# EAGLE design type-2 4 button (EAGLE 9.6.2)
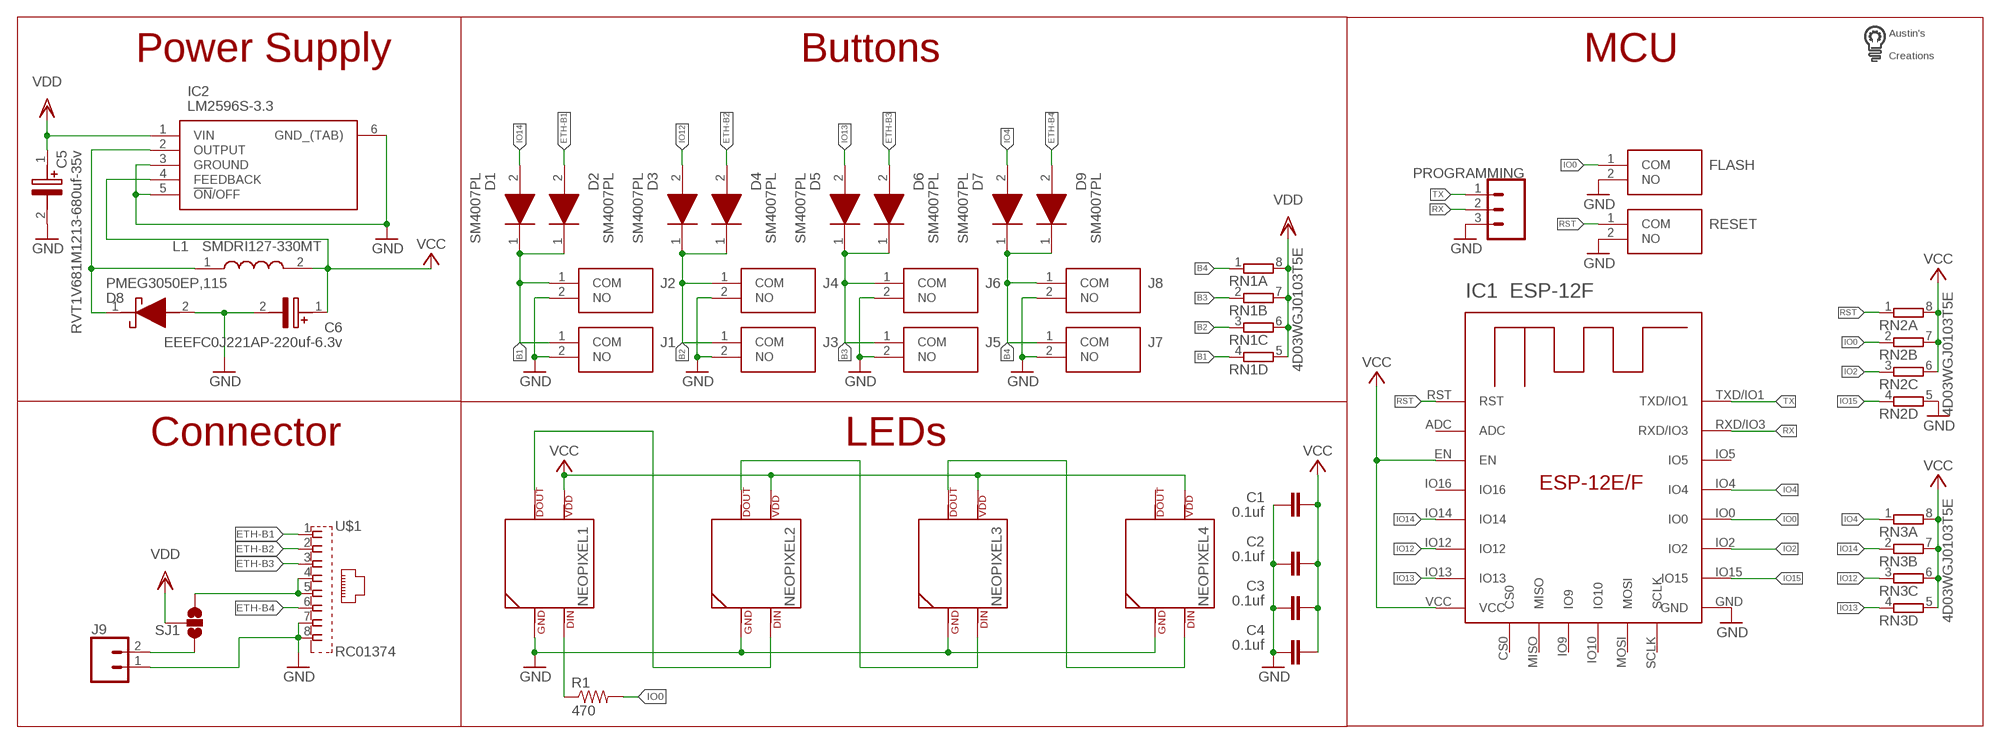
[diagram p0: schematic, sheet 1]

## Parts
C1  0.1uf  C-EUC0603  [C0603]
C2  0.1uf  C-EUC0603  [C0603]
C3  0.1uf  C-EUC0603  [C0603]
C4  0.1uf  C-EUC0603  [C0603]
C5  RVT1V681M1213-680uf-35v  EEE-HD1V681AQ  [CAPAE1350X1400N]
C6  EEEFC0J221AP-220uf-6.3v  EEEFC0J221AP  [CAPAE830X650N]
D1  SM4007PL  [SODFL3718X125N]
D2  SM4007PL  [SODFL3718X125N]
D3  SM4007PL  [SODFL3718X125N]
D4  SM4007PL  [SODFL3718X125N]
D5  SM4007PL  [SODFL3718X125N]
D6  SM4007PL  [SODFL3718X125N]
D7  SM4007PL  [SODFL3718X125N]
D8  PMEG3050EP,115  [PMEG3050EP115]
D9  SM4007PL  [SODFL3718X125N]
FLASH  PTS636_SM25F_SMTR_LFS  [PTS636SM25FSMTRLFS]
IC1  ESP-12F  ESP-12E/F  [ESP-12E]
IC2  LM2596S-3.3  LM2596S-3.3_NOPB  [TO170P1435X465-6N]
J1  PTS636_SM25F_SMTR_LFS  [PTS636SM25FSMTRLFS]
J2  PTS636_SM25F_SMTR_LFS  [PTS636SM25FSMTRLFS]
J3  PTS636_SM25F_SMTR_LFS  [PTS636SM25FSMTRLFS]
J4  PTS636_SM25F_SMTR_LFS  [PTS636SM25FSMTRLFS]
J5  PTS636_SM25F_SMTR_LFS  [PTS636SM25FSMTRLFS]
J6  PTS636_SM25F_SMTR_LFS  [PTS636SM25FSMTRLFS]
J7  PTS636_SM25F_SMTR_LFS  [PTS636SM25FSMTRLFS]
J8  PTS636_SM25F_SMTR_LFS  [PTS636SM25FSMTRLFS]
J9  CONN_025MM  [SCREWTERMINAL-5MM-2]
L1  SMDRI127-330MT  CDRH127_LDNP-330MC  [INDPM120120X800N]
NEOPIXEL1  SK6812NEOPIXEL5050  [SK6812]
NEOPIXEL2  SK6812NEOPIXEL5050  [SK6812]
NEOPIXEL3  SK6812NEOPIXEL5050  [SK6812]
NEOPIXEL4  SK6812NEOPIXEL5050  [SK6812]
PROGRAMMING  455-1750-1-ND  CONN_03  [1X03]
R1  470  R-US_R0603  [R0603]
RESET  PTS636_SM25F_SMTR_LFS  [PTS636SM25FSMTRLFS]
RN1  4R-N0603-ARC  [0603-ARC]
RN2  4R-N0603-ARC  [0603-ARC]
RN3  4R-N0603-ARC  [0603-ARC]
SJ1  SOLDERJUMPER_2WAYPASTE1&2  [SJ_3_PASTE1&2]
U$1  RC01374  [RC01374]
U$2  LOGO  [LOGO]

## Nets
B1: D1.1(K) D2.1(K) J1.1(COM) J2.1(COM) RN1.4
B2: D3.1(K) D4.1(K) J3.1(COM) J4.1(COM) RN1.3
B3: D5.1(K) D6.1(K) J5.1(COM) J6.1(COM) RN1.2
B4: D7.1(K) D9.1(K) J7.1(COM) J8.1(COM) RN1.1
ETH-B1: D2.2(A) U$1.1
ETH-B2: D4.2(A) U$1.2
ETH-B3: D6.2(A) U$1.3
ETH-B4: D9.2(A) U$1.6
GND: C1.1 C2.1 C3.1 C4.1 C5.2(-) C6.2(-) D8.2(A) FLASH.2(NO) IC1.GND IC2.3(GROUND) IC2.5(!ON!/OFF) IC2.6(GND_(TAB)) J1.2(NO) J2.2(NO) J3.2(NO) J4.2(NO) J5.2(NO) J6.2(NO) J7.2(NO) J8.2(NO) J9.1 NEOPIXEL1.3(GND) NEOPIXEL2.3(GND) NEOPIXEL3.3(GND) NEOPIXEL4.3(GND) PROGRAMMING.3 RESET.2(NO) RN2.5 U$1.7 U$1.8
IO0: FLASH.1(COM) IC1.IO0 R1.2 RN2.2
IO2: IC1.IO2 RN2.3
IO4: D7.2(A) IC1.IO4 RN3.1
IO12: D3.2(A) IC1.IO12 RN3.3
IO13: D5.2(A) IC1.IO13 RN3.4
IO14: D1.2(A) IC1.IO14 RN3.2
IO15: IC1.IO15 RN2.4
N$1: NEOPIXEL1.2(DOUT) NEOPIXEL2.4(DIN)
N$2: NEOPIXEL2.2(DOUT) NEOPIXEL3.4(DIN)
N$3: NEOPIXEL3.2(DOUT) NEOPIXEL4.4(DIN)
N$5: NEOPIXEL1.4(DIN) R1.1
N$6: J9.2 SJ1.3
N$12: SJ1.1 U$1.4 U$1.5
N$20: D8.1(K) IC2.2(OUTPUT) L1.1
RST: IC1.RST RESET.1(COM) RN2.1
RX: IC1.RXD/IO3 PROGRAMMING.2
TX: IC1.TXD/IO1 PROGRAMMING.1
VCC: C1.2 C2.2 C3.2 C4.2 C6.1(+) IC1.EN IC1.VCC IC2.4(FEEDBACK) L1.2 NEOPIXEL1.1(VDD) NEOPIXEL2.1(VDD) NEOPIXEL3.1(VDD) NEOPIXEL4.1(VDD) RN2.6 RN2.7 RN2.8 RN3.5 RN3.6 RN3.7 RN3.8
VDD: C5.1(+) IC2.1(VIN) RN1.5 RN1.6 RN1.7 RN1.8 SJ1.2
Unconnected: IC1.ADC IC1.CS0 IC1.IO5 IC1.IO9 IC1.IO10 IC1.IO16 IC1.MISO IC1.MOSI IC1.SCLK NEOPIXEL4.2(DOUT)

## Notes on the sheet
- Power Supply | Buttons | MCU
- 4D03WGJ0103T5E
- 4D03WGJ0103T5E
- Connector | LEDs
- 4D03WGJ0103T5E

## Library data of the parts
C1-C4 = rcl:C-EU: CAPACITOR, European symbol; SPICEPREFIX: C
C5 = SamacSys_Parts:EEE-HD1V681AQ: Aluminium Electrolytic Capacitors - SMD 35VDC 680uF 20% AEC-Q200 Source: Datasheet <https://industrial.panasonic.com/cdbs/www-data/pdf/RDE0000/ABA0000C1166.pdf>; DESCRIPTION: Aluminium Electrolytic Capacitors - SMD 35VDC 680uF 20% AEC-Q200; HEIGHT: 14mm; MANUFACTURER_NAME: Panasonic; MANUFACTURER_PART_NUMBER: EEE-HD1V681AQ; MOUSER_PART_NUMBER: 667-EEE-HD1V681AQ; MOUSER_PRICE-STOCK: https://www.mouser.co.uk/ProductDetail/Panasonic/EEE-HD1V681AQ?qs=w%2Fv1CP2dgqoW7i2Hoqi%252B9w%3D%3D
C6 = SamacSys_Parts:EEEFC0J221AP: PANASONIC - EEEFC0J221AP - SMD Aluminium Electrolytic Capacitor, Radial Can - SMD, 220 F, 6.3 V, EEEFC Series Source: Datasheet <https://industrial.panasonic.com/cdbs/www-data/pdf/RDE0000/ABA0000C1169.pdf>; DESCRIPTION: PANASONIC - EEEFC0J221AP - SMD Aluminium Electrolytic Capacitor, Radial Can - SMD, 220 F, 6.3 V, EEEFC Series; HEIGHT: 6.5mm; MANUFACTURER_NAME: Panasonic; MANUFACTURER_PART_NUMBER: EEEFC0J221AP
D1-D7 D9 = SamacSys_Parts:SM4007PL: 1kV 1A 1.1V @ 1A SOD-123FL Diodes - General Purpose RoHS Source: Datasheet <https://datasheet.lcsc.com/szlcsc/1903051030_MDD-Jiangsu-Yutai-Elec-SM4007PL_C64898.pdf>; DESCRIPTION: 1kV 1A 1.1V @ 1A SOD-123FL Diodes - General Purpose RoHS; HEIGHT: 1.25mm; MANUFACTURER_NAME: MDD(Microdiode Electronics); MANUFACTURER_PART_NUMBER: SM4007PL
D8 = SamacSys_Parts:PMEG3050EP,115: NXP PMEG3050EP,115 SMT Schottky Diode, 30V 5A, 2-Pin SOD-128 Source: Datasheet <https://docs-emea.rs-online.com/webdocs/14cd/0900766b814cd012.pdf>; ARROW_PART_NUMBER: PMEG3050EP,115; ARROW_PRICE-STOCK: https://www.arrow.com/en/products/pmeg3050ep115/nexperia; DESCRIPTION: NXP PMEG3050EP,115 SMT Schottky Diode, 30V 5A, 2-Pin SOD-128; HEIGHT: 1mm; MANUFACTURER_NAME: Nexperia; MANUFACTURER_PART_NUMBER: PMEG3050EP,115; MOUSER_PART_NUMBER: 771-PMEG3050EP115; MOUSER_PRICE-STOCK: https://www.mouser.co.uk/ProductDetail/Nexperia/PMEG3050EP115?qs=GcY6OjH1zdmnjQ%2FhUT5aOA%3D%3D
FLASH J1-J8 RESET = SamacSys_Parts:PTS636_SM25F_SMTR_LFS: Tactile Switches Tact 50mA 12VDC, 6.0x3.5, 2.5mm H, 180gf, F leads, No ground pin, White Actuator Source: Datasheet <https://ms.componentsearchengine.com/Datasheets/1/PTS636 SM25F SMTR LFS.pdf>; ARROW_PART_NUMBER: PTS636 SM25F SMTR LFS; ARROW_PRICE-STOCK: https://www.arrow.com/en/products/pts636-sm25f-smtr-lfs/ck; DESCRIPTION: Tactile Switches Tact 50mA 12VDC, 6.0x3.5, 2.5mm H, 180gf, F leads, No ground pin, White Actuator; HEIGHT: 2.7mm; MANUFACTURER_NAME: C & K COMPONENTS; MANUFACTURER_PART_NUMBER: PTS636 SM25F SMTR LFS; MOUSER_PART_NUMBER: 611-PTS636SM25FSMTRL; MOUSER_PRICE-STOCK: https://www.mouser.co.uk/ProductDetail/CK/PTS636-SM25F-SMTR-LFS?qs=vLWxofP3U2wcBTQSwfMFOw%3D%3D
IC1 = custom parts:ESP-12E/F
IC2 = SamacSys_Parts:LM2596S-3.3_NOPB: SIMPLE SWITCHER® 4.5V to 40V, 3A Low Component Count Step-Down Regulator Source: Datasheet <http://www.ti.com/lit/ds/symlink/lm2596.pdf>; DESCRIPTION: SIMPLE SWITCHER&#174; 4.5V to 40V, 3A Low Component Count Step-Down Regulator; HEIGHT: 4.65mm; MANUFACTURER_NAME: Texas Instruments; MANUFACTURER_PART_NUMBER: LM2596S-3.3/NOPB; MOUSER_PART_NUMBER: 926-LM2596S-3.3/NOPB; MOUSER_PRICE-STOCK: https://www.mouser.co.uk/ProductDetail/Texas-Instruments/LM2596S-33-NOPB?qs=X1J7HmVL2ZHsEwG9Q6doow%3D%3D
J9 = SparkFun-Connectors:CONN_02: Multi connection point. Often used as Generic Header-pin footprint for 0.1 inch spaced/style header connections On any of the 0.1 inch spaced packages, you can populate with these: Break Away Headers - Straight <https://www.sparkfun.com/products/116> (PRT-00116) Break Away Male Headers - Right Angle <https://www.sparkfun.com/products/553> (PRT-00553) Female Headers <https://www.sparkfun.com/products/115> (PRT-00115) Break Away Headers - Machine Pin <https://www.sparkfun.com/products/117> (PRT-00117) Break Away Female Headers - Swiss Machine Pin <https://www.sparkfun.com/products/743> (PRT-00743) For SCREWTERMINALS and SPRING TERMINALS visit here: Screw Terimnals on SparkFun.com <https://www.sparkfun.com/search/results?term=Screw+Terminals> (5mm/3.5mm/2.54mm spacing) This device is also useful as a general connection point to wire up your design to another part of your project. Our various solder wires solder well into these plated through hole pads. Hook-Up Wire - Assortment (Stranded, 22 AWG) <https://www.sparkfun.com/products/11375> (PRT-11375) Hook-Up Wire - Assortment (Solid Core, 22 AWG) <https://www.sparkfun.com/products/11367> (PRT-11367) View the entire wire category on our website here <https://www.sparkfun.com/categories/141> Special notes: Molex polarized connector foot print use with: PRT-08233 with associated crimp pins and housings. 2.54_SCREWTERM for use with PRT-10571. 3.5mm Screw Terminal footprints for PRT-08084 5mm Screw Terminal footprints for use with PRT-08432; SF_SKU: PRT-08432
L1 = SamacSys_Parts:CDRH127_LDNP-330MC: Fixed Inductors 33uH 3.9A Source: Datasheet <https://products.sumida.com/products/pdf/CDRH127LD.pdf>; DESCRIPTION: Fixed Inductors 33uH 3.9A; HEIGHT: 8mm; MANUFACTURER_NAME: Sumida; MANUFACTURER_PART_NUMBER: CDRH127/LDNP-330MC; MOUSER_PART_NUMBER: 851-CDRH127LDNP330MC; MOUSER_PRICE-STOCK: https://www.mouser.co.uk/ProductDetail/Sumida/CDRH127-LDNP-330MC?qs=rZntyWl5IYHj3wgmnQ0WOg%3D%3D
NEOPIXEL1-NEOPIXEL4 = custom parts:SK6812: for 5050 sk6812 LED
PROGRAMMING = SparkFun-Connectors:CONN_03: Multi connection point. Often used as Generic Header-pin footprint for 0.1 inch spaced/style header connections On any of the 0.1 inch spaced packages, you can populate with these: Break Away Headers - Straight <https://www.sparkfun.com/products/116> (PRT-00116) Break Away Male Headers - Right Angle <https://www.sparkfun.com/products/553> (PRT-00553) Female Headers <https://www.sparkfun.com/products/115> (PRT-00115) Break Away Headers - Machine Pin <https://www.sparkfun.com/products/117> (PRT-00117) Break Away Female Headers - Swiss Machine Pin <https://www.sparkfun.com/products/743> (PRT-00743) Stackable Header - 3 Pin (Female, 0.1") <https://www.sparkfun.com/products/13875> (PRT-13875) For SCREWTERMINALS and SPRING TERMINALS visit here: Screw Terimnals on SparkFun.com <https://www.sparkfun.com/search/results?term=Screw+Terminals> (5mm/3.5mm/2.54mm spacing) This device is also useful as a general connection point to wire up your design to another part of your project. Our various solder wires solder well into these plated through hole pads. Hook-Up Wire - Assortment (Stranded, 22 AWG) <https://www.sparkfun.com/products/11375> (PRT-11375) Hook-Up Wire - Assortment (Solid Core, 22 AWG) <https://www.sparkfun.com/products/11367> (PRT-11367) View the entire wire category on our website here <https://www.sparkfun.com/categories/141> Special notes: Molex polarized connector foot print use with SKU : PRT-08232 with associated crimp pins and housings.; PROD_ID: XXX-00000
R1 = resistor:R-US_: RESISTOR, American symbol
RN1-RN3 = custom parts:4R-N: Array Chip Resistor Source: RS Component / Phycomp; OC_FARNELL: unknown; OC_NEWARK: unknown
SJ1 = SparkFun-Retired:SOLDERJUMPER_2WAY: Solder Jumper 2 way solder jumper
U$1 = custom parts:RC01374
U$2 = custom parts:LOGO

## Board
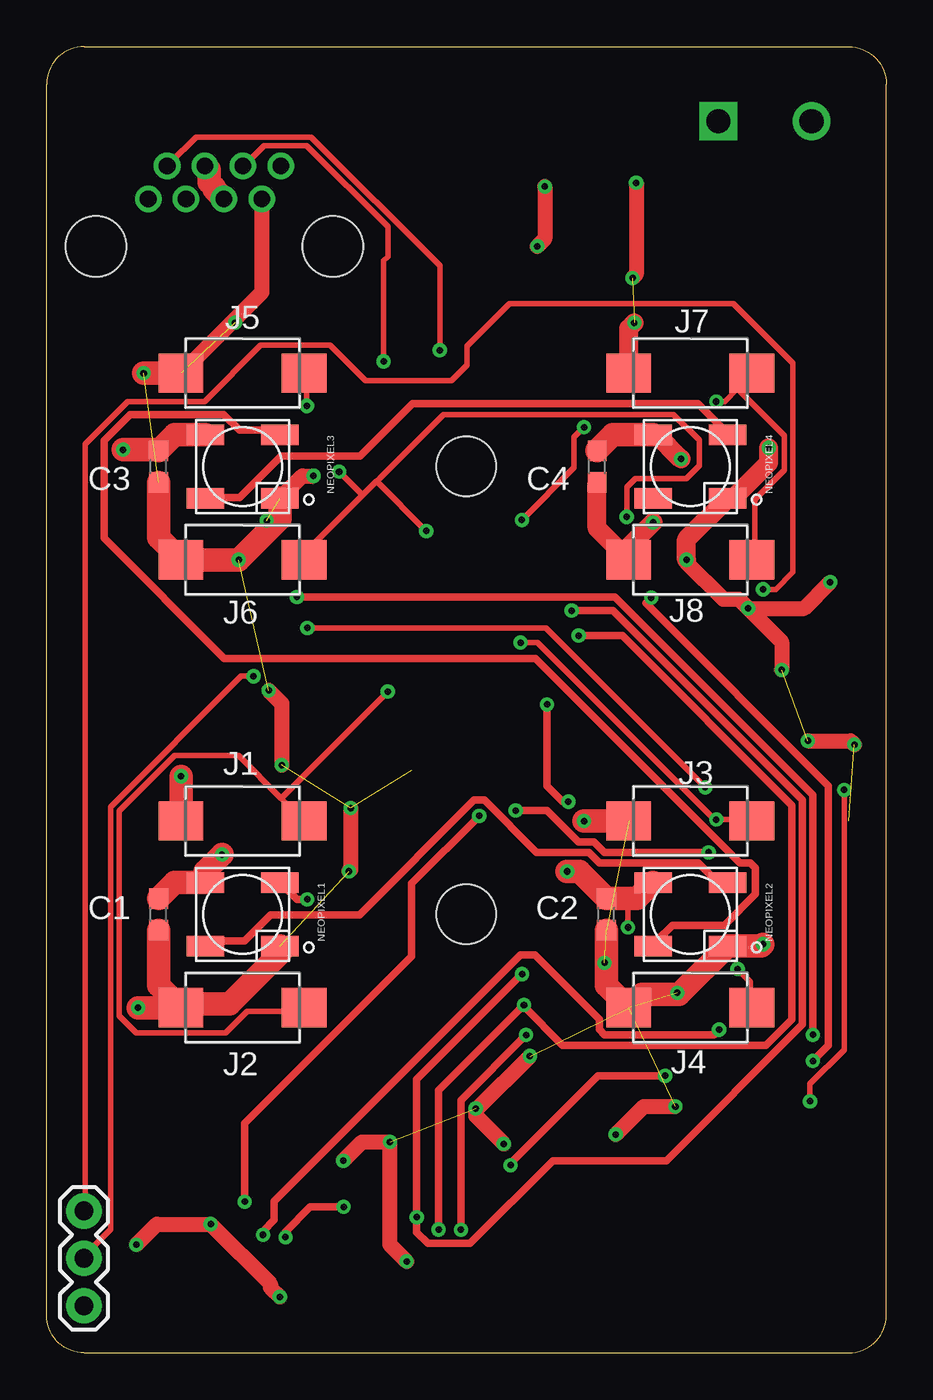
[diagram p1: board, top side]
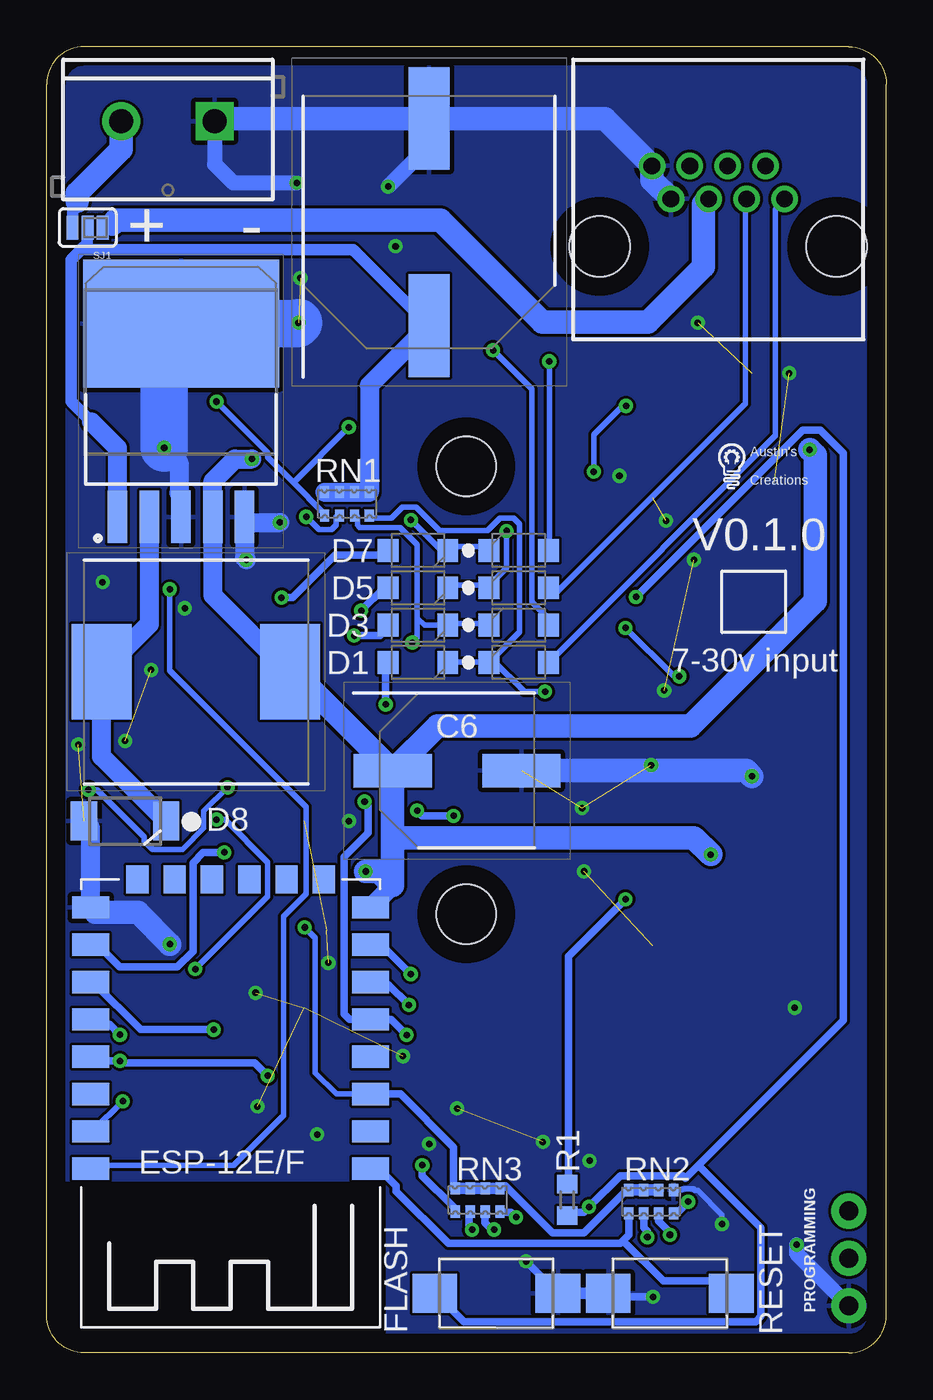
[diagram p2: board, bottom side, seen from below]

Size 45 x 70 mm. Coordinates in mm from the lower left corner, seen from the top.
Outline: 0,2 0,68 arc-90 2,70 43,70 arc-90 45,68 45,2 arc-90 43,0 2,0 arc-90 0,2
Copper layers (1*16): Top 0.035mm / dielectric 1.5mm / Bottom 0.035mm
Design rules "default *": minimum track width 12mil, minimum drill 0.35mm, track to track 6mil, track to pad 6mil, pad to pad 6mil, via to via 6mil, smd to smd 6mil, copper to edge 40mil, drill to drill 6mil, minimum pad ring 10mil, minimum via ring 8mil, stop-mask expansion 4mil, vias tented up to drill 0mil, thermal gap 10mil
Holes 3.2 mm at 22.5,47.5 22.5,23.5

### Footprints (pad centres in the part's own frame; a part is rotated, then mirrored left to right if it is on the bottom)
C0603 = smd 1.1 x 1: 1 -0.85,0; 2 0.85,0
CAPAE1350X1400N = smd 5.5 x 2.2: 1 -5.55,0; 2 5.55,0
CAPAE830X650N = smd 4.2 x 1.8: 1 -3.45,0; 2 3.45,0
SODFL3718X125N = smd 1.12 x 1.22: 1 -1.6,0; 2 1.6,0
PMEG3050EP115 = smd 1.4 x 2.1: 1 -2.2,0; 2 2.2,0
PTS636SM25FSMTRLFS = smd 2.4 x 2.1: 1 -3.3,0; 2 3.3,0
ESP-12E = smd 2 x 1.2: ADC -7.46,5.53; EN -7.46,3.53; GND 7.54,-6.47; IO0 7.54,-0.47; IO2 7.54,-2.47; IO4 7.54,1.53; IO5 7.54,3.53; IO12 -7.46,-2.47; IO13 -7.46,-4.47; IO14 -7.46,-0.47; IO15 7.54,-4.47; IO16 -7.46,1.53; RST -7.46,7.53; RXD/IO3 7.54,5.53; TXD/IO1 7.54,7.53; VCC -7.46,-6.47 | smd 1.2 x 1.5: CS0 -4.96,-7.97; IO9 -0.96,-7.97; IO10 1.04,-7.97; MISO -2.96,-7.97; MOSI 3.04,-7.97; SCLK 5.04,-7.97
TO170P1435X465-6N = smd 2.8 x 1.05: 1 -6.2,3.4; 2 -6.2,1.7; 3 -6.2,0; 4 -6.2,-1.7; 5 -6.2,-3.4 | smd 6.85 x 10.5: 6 4.15,0
SCREWTERMINAL-5MM-2 = drill 1.3 pad 2.032 square: 1 0,0 | drill 1.3 pad 2.032: 2 5,0
INDPM120120X800N = smd 3.2 x 5.1: 1 -5.05,0; 2 5.05,0
SK6812 = smd 2 x 1.1: 1 -2,1.7; 2 -2,-1.7; 3 2,-1.7; 4 2,1.7
1X03 = drill 1.016 pad 1.88: 1 0,0; 2 2.54,0; 3 5.08,0
R0603 = smd 1 x 1.1: 1 -0.85,0; 2 0.85,0
0603-ARC = smd 0.5 x 0.65: 1 -1.2,-0.625; 2 -0.4,-0.625; 3 0.4,-0.625; 4 1.2,-0.625; 5 1.2,0.625; 6 0.4,0.625; 7 -0.4,0.625; 8 -1.2,0.625
SJ_3_PASTE1&2 = smd 0.635 x 1.27: 1 -0.813,0; 2 0,0; 3 0.813,0
RC01374 = drill 0.889 pad 1.422: 1 3.556,2.54; 2 2.54,4.318; 3 1.524,2.54; 4 0.508,4.318; 5 -0.508,2.54; 6 -1.524,4.318; 7 -2.54,2.54; 8 -3.556,4.318 | hole 3.251: 6.35,0; -6.35,0

### Placement (x,y rotation side)
C1  6,23.5 90 top
C2  30,23.5 90 top
C3  6,47.5 90 top
C4  29.5,47.5 90 top
C5  24.5,60.6 90 bottom
C6  23,31.2 0 bottom
D1  25.1,37 180 bottom
D2  19.7,37 0 bottom
D3  25.1,39 180 bottom
D4  19.7,39 0 bottom
D5  25.1,41 180 bottom
D6  19.7,41 0 bottom
D7  25.1,43 180 bottom
D8  40.8,28.5 180 bottom
D9  19.7,43 0 bottom
FLASH  20.9,3.2 0 bottom
IC1  35.1,17.4 180 bottom
IC2  37.8,51 90 bottom
J1  10.5,28.5 180 top
J2  10.5,18.5 180 top
J3  34.5,28.5 180 top
J4  34.5,18.5 180 top
J5  10.5,52.5 180 top
J6  10.5,42.5 180 top
J7  34.5,52.5 180 top
J8  34.5,42.5 180 top
J9  36,66 180 bottom
L1  37,36.5 0 bottom
NEOPIXEL1  10.5,23.5 0 top
NEOPIXEL2  34.5,23.5 0 top
NEOPIXEL3  10.5,47.5 0 top
NEOPIXEL4  34.5,47.5 0 top
PROGRAMMING  2,7.6 270 top
R1  17.1,8.2 270 bottom
RESET  11.6,3.2 180 bottom
RN1  28.9,45.5 0 bottom
RN2  12.6,8.1 0 bottom
RN3  21.9,8.2 0 bottom
SJ1  42.8,60.3 180 bottom
U$1  9,59.3 0 bottom
U$2  9,46.3 0 bottom

### Tracks (layer width: path | path; a pad name or v marks a point on that pad's centre or on a via)
B1  (via drill 0.35)
  Top 0.305: 12.57,29.72 13.72,28.57 J1.1 | 12.57,29.72 10.29,32 6.86,32 3.89,29.03 3.89,18.06 4.8,17.14 9.6,17.14 10.74,18.29 13.72,18.29 J2.1 | 12.57,29.72 v18.29,35.43
  Bottom 0.305: RN1.4 27.56,44.73 26.52,44.73 25.93,45.32 25.19,45.32 23.95,44.08 21.36,44.08 20.7,44.73 19.99,44.73 19.66,44.41 19.66,38.63 21.12,37.17 | 21.12,37.17 21.26,37.03 D2.1 21.49,37.03 23.32,37.03 D1.1 | 21.12,37.17 19.39,35.43 v18.29,35.43
B2  (via drill 0.35)
  Top 0.305: v37.03,20.57 37.72,19.89 37.72,18.52 J4.1 | J3.1 37.72,28.57 v35.89,28.57 35.69,28.77 35.59,28.77 26.3,38.06 v25.4,38.06
  Bottom 0.305: 25.16,39.3 25.16,38.3 v25.4,38.06 | 25.16,39.3 25.16,43.32 26.06,44.22 28.22,44.22 28.35,44.35 28.35,44.81 RN1.3 | D4.1 21.49,39.09 23.32,39.09 D3.1 24.75,39 25.11,39.35 25.16,39.3 | v37.03,20.57 33.15,24.46 33.15,26.29 35.43,28.57 v35.89,28.57
B3  (via drill 0.35)
  Top 0.305: v31.09,44.81 31.09,46.41 31.55,46.86 34.29,46.86 34.98,47.55 34.98,48.92 33.6,50.29 21.26,50.29 17.83,46.86 17.68,46.71 | 17.68,46.71 13.95,42.98 13.95,42.52 J6.1 | 17.68,46.71 16.93,45.96 v15.67,47.22 | 17.68,46.71 v20.34,44.05 | v13.95,50.75 13.95,52.35 J5.1
  Bottom 0.305: D5.1 23.32,41.15 21.49,41.15 D6.1 21.26,41.15 20.34,42.06 v20.34,44.05 | v31.09,44.81 30.4,44.12 29.72,44.12 29.49,44.35 29.49,44.81 RN1.2 | v15.67,47.22 15.67,49.22 14.14,50.75 v13.95,50.75
B4  (via drill 0.35)
  Top 0.305: v35.89,50.98 36.35,50.98 37.03,51.66 | 37.03,51.66 37.72,52.35 J7.1 37.03,51.66 | v25.48,44.63 28.27,47.43 28.27,49.08 v28.8,49.61 | 37.03,51.66 39.55,49.15 39.55,47.32 37.95,45.72 37.95,42.52 J8.1
  Bottom 0.305: D9.1 21.49,43.2 23.32,43.2 D7.1 23.84,43 v25.48,44.63 | 31.77,46.63 33.15,48.01 33.15,48.23 v35.89,50.98 | 31.77,46.63 30.18,45.03 RN1.1 | 31.77,46.63 v28.8,49.61
ETH-B1
  Bottom 0.305: D2.2 18.06,37.03 5.94,49.15 5.94,61.27 5.49,61.72 U$1.1
ETH-B2  (via drill 0.35)
  Top 0.305: v21.07,53.73 21.07,58.25 14.17,65.15 8,65.15 6.63,63.78 U$1.2
  Bottom 0.305: v21.07,53.73 18.97,51.63 18.97,40.23 18.29,39.55 18.29,39.09 D4.2
ETH-B3
  Bottom 0.305: D6.2 17.75,40.65 7.54,50.86 7.54,61.72 U$1.3
ETH-B4  (via drill 0.35)
  Top 0.305: v18.06,53.13 18.06,58.52 18.29,58.75 18.29,60.35 13.95,64.69 11.66,64.69 10.74,63.78 U$1.6
  Bottom 0.305: v18.06,53.13 18.06,43.2 D9.2
GND  (via drill 0.35)  (16 unrouted)
  Top 0.813: v16.3,29.2 16.3,25.9 v16.2,25.8 | v37.6,39.9 37.11,40.39 36.27,40.39 34.3,42.36 v34.3,42.5 | v37.6,39.9 40.6,39.9 v42,41.3 | v40.8,32.8 43.1,32.8 v43.3,32.6 | v37.6,39.9 39.4,38.1 v39.4,36.6 | v4.8,5.8 5.9,6.9 v8.8,6.9 12,3.7 12,3.5 v12.5,3 | v15.9,10.3 16.9,11.3 v18.4,11.3 18.4,5.8 v19.3,4.9 | v24.5,11.2 23,12.7 v23,13.1 23.1,13.1 v25.9,15.9 | v30.5,11.7 32,13.2 v33.7,13.2 | NEOPIXEL3.3 13.7,47 v14.3,47 | v11.9,35.5 12.6,34.8 v12.6,31.5 | J5.2 11.54,56.84 U$1.7 | v31.6,62.7 31.6,57.8 v31.4,57.6 | v26.7,62.5 26.7,59.7 v26.3,59.3
  Top 1.016: v32.5,44.5 31.2,43.2 J8.2 29.5,44.2 C4.1 | v34.3,42.5 34.3,43.6 NEOPIXEL4.3 36.8,45.8 38.7,47.7 v38.7,48.5 | J7.2 31.2,54.9 v31.5,55.2
  Top 1.27: v38.4,21.9 38.3,21.8 NEOPIXEL2.3 33.9,19.2 31.9,19.2 J4.2 30,19.7 C2.1 | J3.2 v28.8,28.5 | v7.2,30.9 J1.2 | C1.1 6,19.7 J2.2 | J2.2 7.4,18.7 9.8,18.7 12.5,21.4 NEOPIXEL1.3 | J2.2 v4.9,18.5 | C3.1 6,43.7 J6.2 v10.3,42.5 12.5,44.7 NEOPIXEL3.3 | J5.2 v5.2,52.5
  Bottom 0.305: RN2.5 10.96,8.72 10.9,8.79 10.33,8.79 10.25,8.7 10.1,8.7 8.8,7.4 v8.8,6.9
  Bottom 0.406: RESET.2 14.7,3 v12.5,3 | FLASH.2 v19.3,4.9
  Bottom 0.61: RESET.2 FLASH.2
  Bottom 0.813: PROGRAMMING.3 4.8,5.32 v4.8,5.8 | J9.1 36,63.7 35,62.7 v31.6,62.7 | C5.2 24.5,64.7 v26.7,62.5
  Bottom 1.016: v32.5,44.5 34.1,44.5 IC2.5 34.4,42.6 v34.3,42.5 | v38.7,48.5 37.9,47.7 37.9,46.1 37.8,46 IC2.3 | IC1.GND 42.64,28.14 D8.2
  Bottom 1.27: U$1.7 12.56,62.86 U$1.8 15.09,66.15 C5.2 35.85,66.15 J9.1 | IC1.GND 42.37,23.6 40.1,23.6 v38.4,21.9 | C6.2 7.5,31.2 v7.2,30.9
  Bottom 2.54: v31.5,55.2 31.55,55.15 IC2.6 38.7,54.25 v38.7,48.5
  other vias: 33.8,19.3 29.9,20.9 11.8,44.6 10.1,55.2
  pour Bottom: 0,0 0,70 45,70 45,9.2 26.8,9.2 26.8,0
IO0  (via drill 0.35)
  Top 0.406: v41.07,17.04 41.07,29.9 30.45,40.51 v13.41,40.51 | v12.8,6.2 12.8,6.5 14.12,7.82 v15.93,7.82
  Bottom 0.406: 10.06,10.06 6.71,6.71 6.71,1.96 6.99,1.68 22.63,1.68 24.03,3.07 FLASH.1 | R1.2 17.04,7.54 16.2,7.54 v15.93,7.82 14.25,9.5 10.9,9.5 10.76,9.36 10.06,10.06 | v41.07,17.04 41.63,17.6 42.47,17.6 IC1.IO0 | v13.41,40.51 4.47,49.45 3.53,49.45 2.3,48.22 2.3,17.82 10.06,10.06 | RN2.2 13,6.71 12.8,6.5 v12.8,6.2
IO2  (via drill 0.35)
  Top 0.406: v11.59,6.33 11.59,6.53 12.19,7.13 12.19,8.12 25.41,21.33 26.16,21.33 29.62,17.88 29.62,17.32 29.9,17.04 35.76,17.04 v36.04,17.32
  Bottom 0.406: RN2.3 12.2,7.08 11.59,6.47 v11.59,6.33 | v36.04,17.32 39.95,17.32 42.47,19.84 IC1.IO2
IO4  (via drill 0.35)
  Top 0.406: v33.16,14.85 29.55,14.85 24.87,10.16 v24.87,10.06 | v32.41,40.48 32.11,40.17 41.91,30.38 41.91,16.48 v41.07,15.65
  Bottom 0.406: v24.87,10.06 24.87,9.5 23.19,7.82 RN3.1 | v33.16,14.85 33.85,15.55 40.97,15.55 v41.07,15.65 42.47,15.65 IC1.IO4 | v32.41,40.48 31.81,40.48 29.54,42.75 26.82,42.75 D7.2
IO12  (via drill 0.35)
  Top 0.406: v21.01,6.61 21.01,14.07 v25.58,18.64 25.58,18.56 27.66,16.48 38.56,16.48 39.95,17.88 39.95,29.34 30.86,38.44 v28.52,38.44
  Bottom 0.406: v21.01,6.61 21.13,6.61 21.5,6.97 RN3.3 | v25.58,18.64 26.7,19.75 IC1.IO12 | v28.52,38.44 27.12,38.44 D3.2
IO13  (via drill 0.35)
  Top 0.406: v25.48,20.3 19.84,14.65 v19.84,7.26 19.84,6.46 20.43,5.87 22.69,5.87 27.12,10.3 33.21,10.3 40.51,17.6 40.51,29.62 30.36,39.77 v28.14,39.77
  Bottom 0.406: v19.84,7.26 20.12,7.54 20.68,7.54 RN3.4 | v25.48,20.3 26.81,21.62 IC1.IO13 | v28.14,39.77 26.91,41 D5.2
IO14  (via drill 0.35)
  Top 0.406: v26.82,34.75 26.82,30.38 27.66,29.54 v27.96,29.54 | v25.7,17.04 22.2,13.54 v22.2,6.6
  Bottom 0.406: RN3.2 22.35,7.54 22.35,6.75 v22.2,6.6 | v26.82,34.75 26.82,36.88 D1.2 | v27.96,29.54 27.76,29.34 27.76,27.86 29.06,26.56 29.06,18.16 28.77,17.87 IC1.IO14 26.53,17.87 v25.7,17.04
IO15  (via drill 0.35)
  Top 0.406: v10.62,8.1 10.62,12.29 19.56,21.23 19.56,25.15 v23.19,28.78 | v25.15,29.06 26.82,29.06 28.5,27.38 29.34,27.38 29.9,26.82 v35.48,26.82
  Bottom 0.406: v10.62,8.1 11.18,7.54 RN2.4 | v23.19,28.78 24.87,28.78 v25.15,29.06 | v35.48,26.82 36.6,26.82 37.16,26.26 37.16,21.51 38,20.68 41.07,20.68 42.47,22.07 IC1.IO15
N$1
  Top 0.406: NEOPIXEL1.2 8.66,22.07 10.62,22.07 12.01,23.47 16.76,23.47 22.91,29.62 23.47,29.62 26.26,26.82 29.06,26.82 29.62,26.26 34.92,26.26 35.76,25.43 36.32,25.43 NEOPIXEL2.4
N$2
  Top 0.406: NEOPIXEL3.4 12.29,49.45 10.34,49.45 9.5,50.29 4.47,50.29 3.07,48.9 3.07,43.67 9.52,37.22 26.2,37.22 37.16,26.26 37.72,26.26 38,25.98 38,24.59 36.32,22.91 33.53,22.91 32.69,22.07 NEOPIXEL2.2
N$3
  Top 0.406: NEOPIXEL3.2 8.66,45.82 10.34,45.82 12.57,48.06 16.8,48.06 19.61,50.87 34.9,50.87 36.32,49.45 NEOPIXEL4.4
N$5  (via drill 0.35)
  Top 0.406: v13.97,24.31 13.41,24.31 12.57,25.15 NEOPIXEL1.4
  Bottom 0.406: v13.97,24.31 17.04,21.23 17.04,9.22 R1.1
N$6
  Bottom 0.61: SJ1.3 43.61,61.46 43.35,61.72
  Bottom 1.27: J9.2 41,64.5 43.35,62.15 43.35,61.72
N$12
  Top 1.27: U$1.4 8.7,63.41 8.7,62.73 8.97,62.46 8.97,62.37 U$1.5
  Bottom 0.61: SJ1.1 41.79,60.5 41.5,60.5
  Bottom 1.27: U$1.5 9.8,61.55 9.8,58.2 12.78,55.22 18.42,55.22 23.9,60.7 41.3,60.7 41.5,60.5
N$20
  Bottom 1.016: IC2.2 39.5,39.05 L1.1 42.05,31.95 D8.1
RST
  Bottom 0.406: 14.1,6.02 11.94,3.85 8.65,3.85 RESET.1 | RN2.1 13.79,7.46 13.79,6.33 14.1,6.02 | 14.1,6.02 14.25,5.87 23.47,5.87 26.26,8.66 26.26,8.94 27.1,9.78 27.38,9.78 IC1.RST
RX  (via drill 0.35)
  Top 0.305: v40.92,13.49 40.92,14.4 42.75,16.23 v42.75,30.18 | v35.3,30.3 26.76,38.85 v13.97,38.85 | v11.09,36.26 10.43,36.26 3.43,29.26 3.43,6.63 2.06,5.26 PROGRAMMING.2
  Bottom 0.305: v40.92,13.49 42.52,11.89 IC1.RXD/IO3 | v42.75,30.18 42.29,30.18 39.78,27.66 39.78,27.43 39.32,26.98 37.72,26.98 36.58,28.12 36.58,29.03 v35.3,30.3 | v13.97,38.85 11.39,36.26 v11.09,36.26
TX  (via drill 0.35)
  Top 0.305: v38.41,40.92 39.09,40.92 40.01,41.83 40.01,53.03 36.8,56.24 24.82,56.24 22.53,53.95 22.53,52.93 21.7,52.1 17.1,52.1 15.2,54 11.48,54 8.46,50.98 4.34,50.98 2.06,48.69 2.06,7.77 PROGRAMMING.1
  Bottom 0.305: v38.41,40.92 38.41,36.58 31.09,29.26 31.09,24.6 32.3,23.39 32.3,12.73 34.98,10.06 42.52,10.06 IC1.TXD/IO1
VCC  (via drill 0.35)
  Top 0.305: 30.8,24.35 31.17,23.98 v31.17,22.8
  Top 1.016: v34,47.9 32.7,49.2 NEOPIXEL4.1
  Top 1.27: v27.9,25.8 28.55,25.8 C2.2 30.8,24.35 31.65,24.35 NEOPIXEL2.1 | C1.2 6.85,25.2 NEOPIXEL1.1 8.5,25.8 v9.4,26.7 | v4.1,48.4 5.95,48.4 C3.2 6.85,49.2 NEOPIXEL3.1 | NEOPIXEL4.1 30.35,49.2 C4.2
  Bottom 0.305: v31.17,22.8 30.6,22.23 30.6,15 29.47,13.87 27.9,13.87 IC1.EN
  Bottom 0.406: RN2.8 13.97,8.66 16.2,6.43 17.88,6.43 20.4,8.94 RN3.5 | RN3.8 23.19,8.94 23.19,11.02 26.04,13.87 27.9,13.87
  Bottom 0.61: RN3.5 RN3.6 RN3.7 RN3.8 | RN2.8 RN2.7 RN2.6
  Bottom 1.016: L1.2 32,36.5 36.1,40.6 IC2.4 36.1,46.7 34.9,47.9 v34,47.9 | 26.45,25.06 IC1.VCC
  Bottom 1.27: C6.1 31.75,36.5 32,36.5 | 26.45,27.6 26.45,25.06 27.19,25.8 v27.9,25.8 | 26.45,27.6 C6.1 | 26.45,27.6 10.3,27.6 v9.4,26.7 | C6.1 24.05,33.6 10.5,33.6 3.8,40.3 3.8,48.1 v4.1,48.4
VDD
  Bottom 0.61: SJ1.2 42.84,60.26 42.84,59.48 43.2,59.11 | 43.2,59.11 43.2,59.07 43.68,58.59 43.68,50.98 42.6,49.9 | 43.2,59.11 28.56,59.11 C5.1
  Bottom 1.016: IC2.1 41.2,48.5 42.6,49.9 | RN1.8 RN1.7 RN1.6 RN1.5 27.7,51.85 C5.1

### Text on the board
bPlace: + - | V0.1.0 | 7-30v input